# EAGLE design MgdOpna (EAGLE 9.6.2)
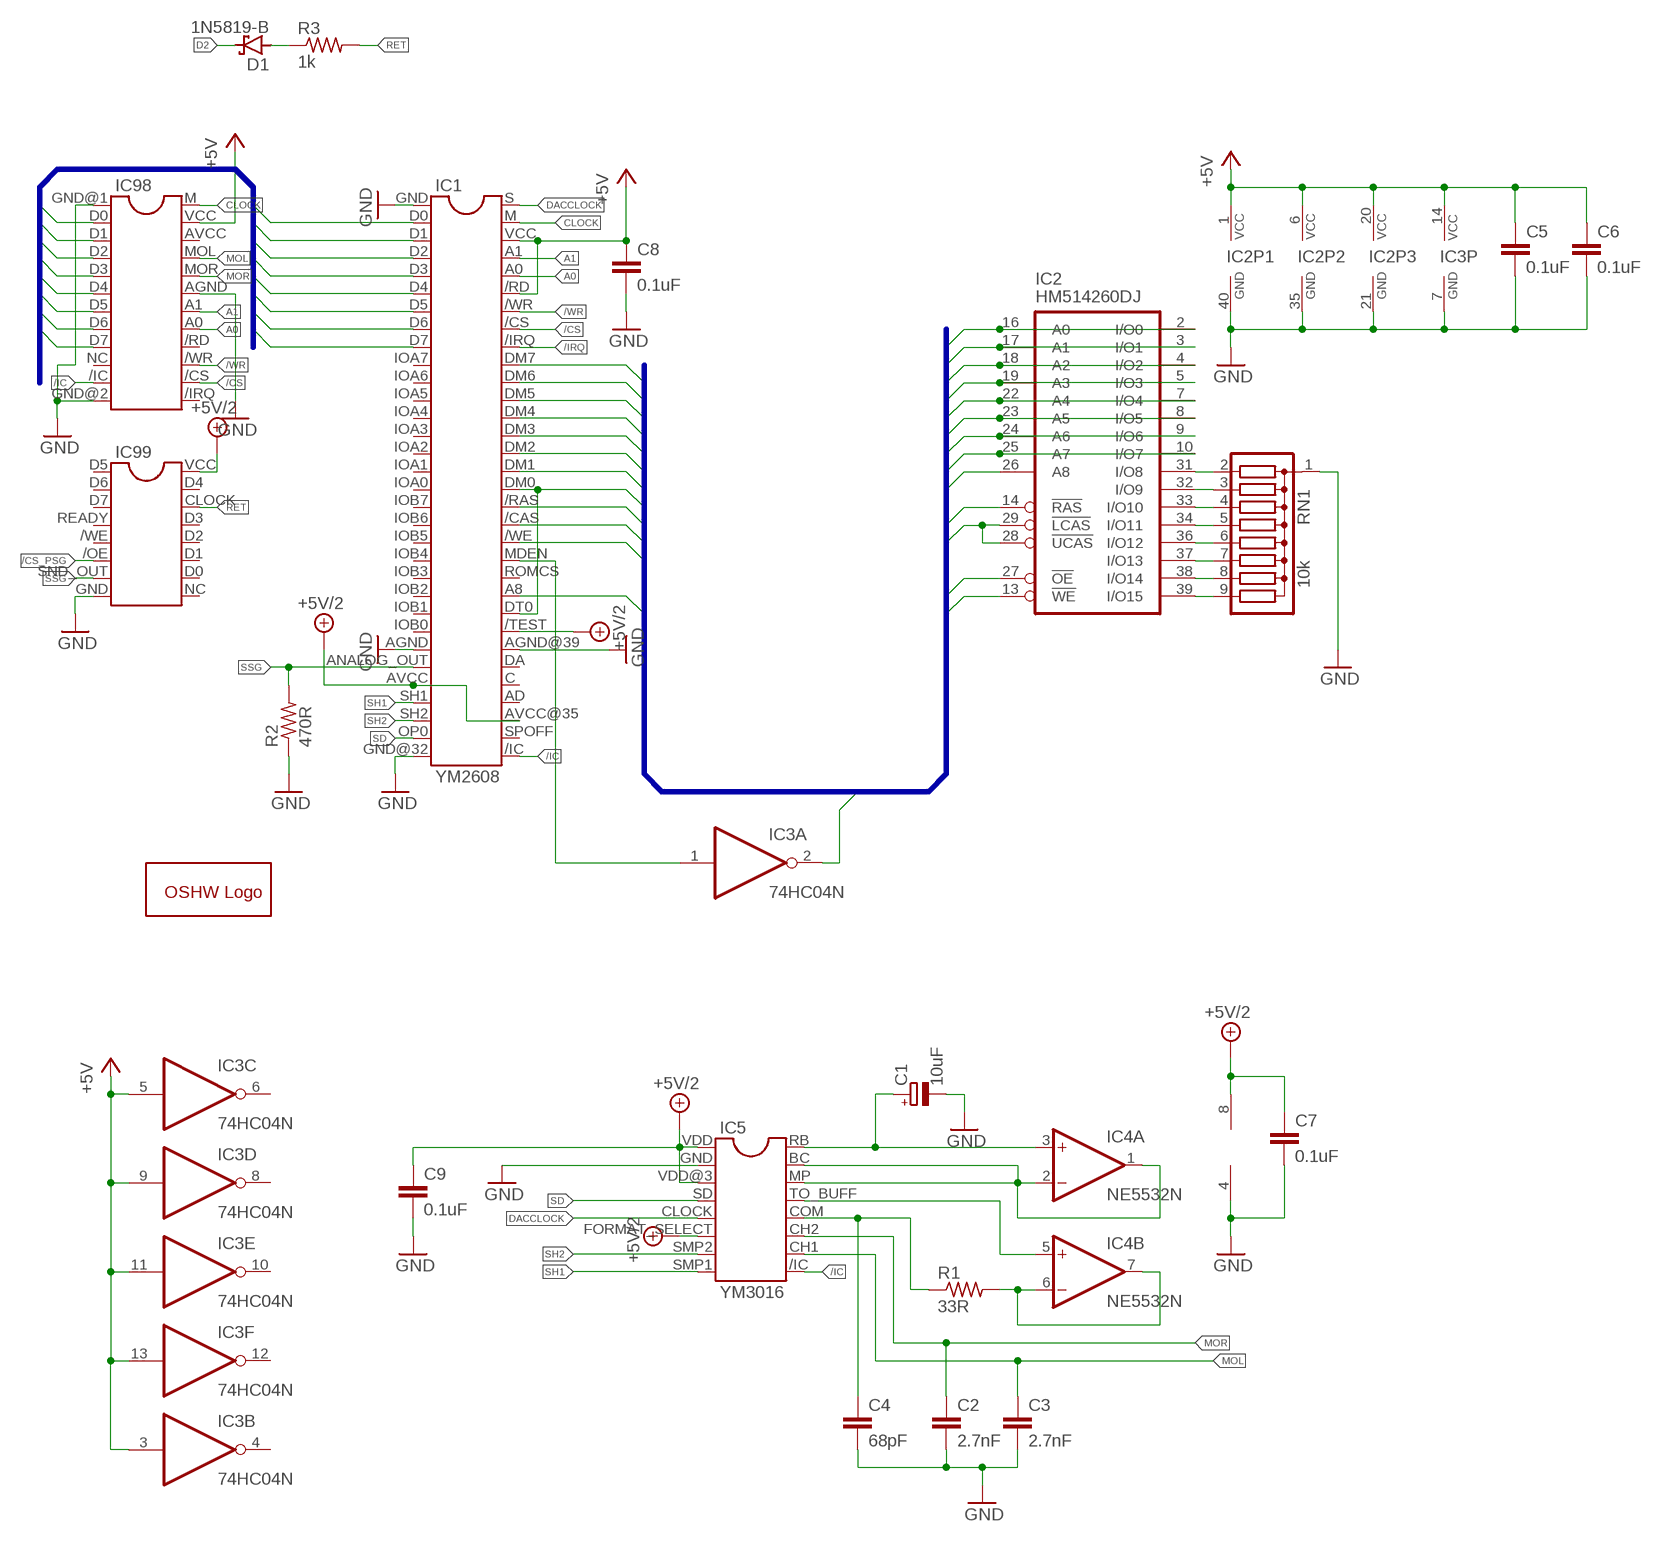
[diagram p0: schematic, sheet 1]

## Parts
C1  10uF  CPOL-EUE2.5-5  [E2,5-5]
C2  2.7nF  C-EU025-024X044  [C025-024X044]
C3  2.7nF  C-EU025-024X044  [C025-024X044]
C4  68pF  C-EU025-024X044  [C025-024X044]
C5  0.1uF  C-EU025-024X044  [C025-024X044]
C6  0.1uF  C-EU025-024X044  [C025-024X044]
C7  0.1uF  C-EU025-024X044  [C025-024X044]
C8  0.1uF  C-EU025-024X044  [C025-024X044]
C9  0.1uF  C-EU025-024X044  [C025-024X044]
D1  1N5819-B  [DO41-7.6]
GOLD_ORB_SM1  OSHWLOGOLOGO8MM  [OSHW_8MM]
IC1  YM2608  [YM2608]
IC2  HM514260DJ  [SOJ40-4]
IC3  74HC04N  [DIL14]
IC4  NE5532N  [DIL08]
IC5  YM3016  [YM3016]
IC98  YM2612YM2612_NOSILK  [YM2612_NOSILK]
IC99  SN76489SN76489_NOSILK  [SN76489_NOSILK]
R1  33R  R-US_0204/7  [0204/7]
R2  470R  R-US_0204/7  [0204/7]
R3  1k  R-US_0204/7  [0204/7]
RN1  10k  G08R  [SIL9]

## Nets
+5V: C5.1 C6.1 C8.1 IC1./RD IC1.VCC IC2.1(VCC) IC2.6(VCC) IC2.20(VCC) IC3.3(B:I) IC3.5(C:I) IC3.9(D:I) IC3.11(E:I) IC3.13(F:I) IC3.14(P:VCC) IC98.VCC
+5V/2: C7.1 C9.1 IC1./TEST IC1.AVCC IC1.AVCC@35(AVCC) IC4.8(P:V+) IC5.FORMAT_SELECT IC5.VDD IC5.VDD@3 IC99.VCC
/CAS: IC1./CAS IC2.28(!UCAS) IC2.29(!LCAS)
/CS: IC1./CS IC98./CS
/CS_PSG: IC99./OE
/IC: IC1./IC IC5./IC IC98./IC
/IRQ: IC1./IRQ
/OE: IC2.27(!OE) IC3.2(A:O)
/RAS: IC1./RAS IC2.14(!RAS)
/WE: IC1./WE IC2.13(!WE)
/WR: IC1./WR IC98./WR
A0: IC1.A0 IC98.A0
A1: IC1.A1 IC98.A1
A8: IC1.A8 IC2.26(A8)
CLOCK: IC1.M IC98.M
D0: IC1.D0 IC98.D0
D1: IC1.D1 IC98.D1
D2: D1.C IC1.D2 IC98.D2
D3: IC1.D3 IC98.D3
D4: IC1.D4 IC98.D4
D5: IC1.D5 IC98.D5
D6: IC1.D6 IC98.D6
D7: IC1.D7 IC98.D7
DACCLOCK: IC1.S IC5.CLOCK
DM0: IC1.DM0 IC1.DT0(DTO) IC2.2(I/O0) IC2.16(A0)
DM1: IC1.DM1 IC2.3(I/O1) IC2.17(A1)
DM2: IC1.DM2 IC2.4(I/O2) IC2.18(A2)
DM3: IC1.DM3 IC2.5(I/O3) IC2.19(A3)
DM4: IC1.DM4 IC2.7(I/O4) IC2.22(A4)
DM5: IC1.DM5 IC2.8(I/O5) IC2.23(A5)
DM6: IC1.DM6 IC2.9(I/O6) IC2.24(A6)
DM7: IC1.DM7 IC2.10(I/O7) IC2.25(A7)
GND: C1.- C2.2 C3.2 C4.2 C5.2 C6.2 C7.2 C8.2 C9.2 IC1.AGND IC1.AGND@39(AGND) IC1.GND IC1.GND@32(GND) IC2.21(GND) IC2.35(GND) IC2.40(GND) IC3.7(P:GND) IC4.4(P:V-) IC5.GND IC98.AGND IC98.GND@1(GND) IC98.GND@2(GND) IC99.GND R2.1 RN1.1
MOL: C3.1 IC5.CH1 IC98.MOL
MOR: C2.1 IC5.CH2 IC98.MOR
N$1: IC2.31(I/O8) RN1.2
N$2: IC2.32(I/O9) RN1.3
N$3: IC2.33(I/O10) RN1.4
N$4: IC2.34(I/O11) RN1.5
N$5: IC2.36(I/O12) RN1.6
N$6: IC2.37(I/O13) RN1.7
N$7: IC2.38(I/O14) RN1.8
N$8: IC2.39(I/O15) RN1.9
N$9: D1.A R3.1
N$10: IC1.MDEN IC3.1(A:I)
N$11: C1.+ IC4.3(A:+IN) IC5.RB
N$12: IC4.1(A:OUT) IC4.2(A:-IN) IC5.BC IC5.MP
N$13: IC4.5(B:+IN) IC5.TO_BUFF
N$14: IC4.6(B:-IN) IC4.7(B:OUT) R1.2
N$15: C4.1 IC5.COM R1.1
RET: IC99.CLOCK R3.2
SD: IC1.OP0 IC5.SD
SH1: IC1.SH1 IC5.SMP1
SH2: IC1.SH2 IC5.SMP2
SSG: IC1.ANALOG_OUT IC99.SND_OUT R2.2
Unconnected: IC1.AD IC1.C IC1.DA IC1.IOA0 IC1.IOA1 IC1.IOA2 IC1.IOA3 IC1.IOA4 IC1.IOA5 IC1.IOA6 IC1.IOA7 IC1.IOB0 IC1.IOB1 IC1.IOB2 IC1.IOB3 IC1.IOB4 IC1.IOB5 IC1.IOB6 IC1.IOB7 IC1.ROMCS IC1.SPOFF IC2.11(NC) IC2.12(NC) IC2.15(NC) IC2.30(NC) IC3.4(B:O) IC3.6(C:O) IC3.8(D:O) IC3.10(E:O) IC3.12(F:O) IC98./IRQ IC98./RD IC98.AVCC IC98.NC IC99./WE IC99.D0 IC99.D1 IC99.D2 IC99.D3 IC99.D4 IC99.D5 IC99.D6 IC99.D7 IC99.NC IC99.READY

## Buses
A[0..1],AVCC,/CS,D[0..7],/IC,M,/RD,VCC,/WR
A8,/CAS,DM[0..7],/OE,/RAS,/WE

## Library data of the parts
C1 = rcl:CPOL-EU: POLARIZED CAPACITOR, European symbol; SPICEPREFIX: C
C2-C9 = rcl:C-EU: CAPACITOR, European symbol; SPICEPREFIX: C
D1 = diode:1N581*: 1.0A SCHOTTKY BARRIER RECTIFIER Source: http://www.diodes.com/datasheets/ds23001.pdf
GOLD_ORB_SM1 = oshw:OSHWLOGO: The OSHW logo for PCB layout
IC1 = yammy-ha:YM2608
IC2 = memories:HM514260D: DRAM 256K x16 NEC Electronics Inc.
IC3 = 74xx-eu:74*04: Hex INVERTER
IC4 = linear:NE5532: AUDIO AMPLIFIER
IC5 = yammy-ha:YM3016
IC98 = yammy-ha:YM2612: Dual In Line
IC99 = retrosound:SN76489: Dual In Line / Socket
R1-R3 = rcl:R-US_: RESISTOR, American symbol; SPICEPREFIX: R
RN1 = resistor-sil:G08R: SIL RESISTOR; OC_FARNELL: unknown; OC_NEWARK: unknown

## Board
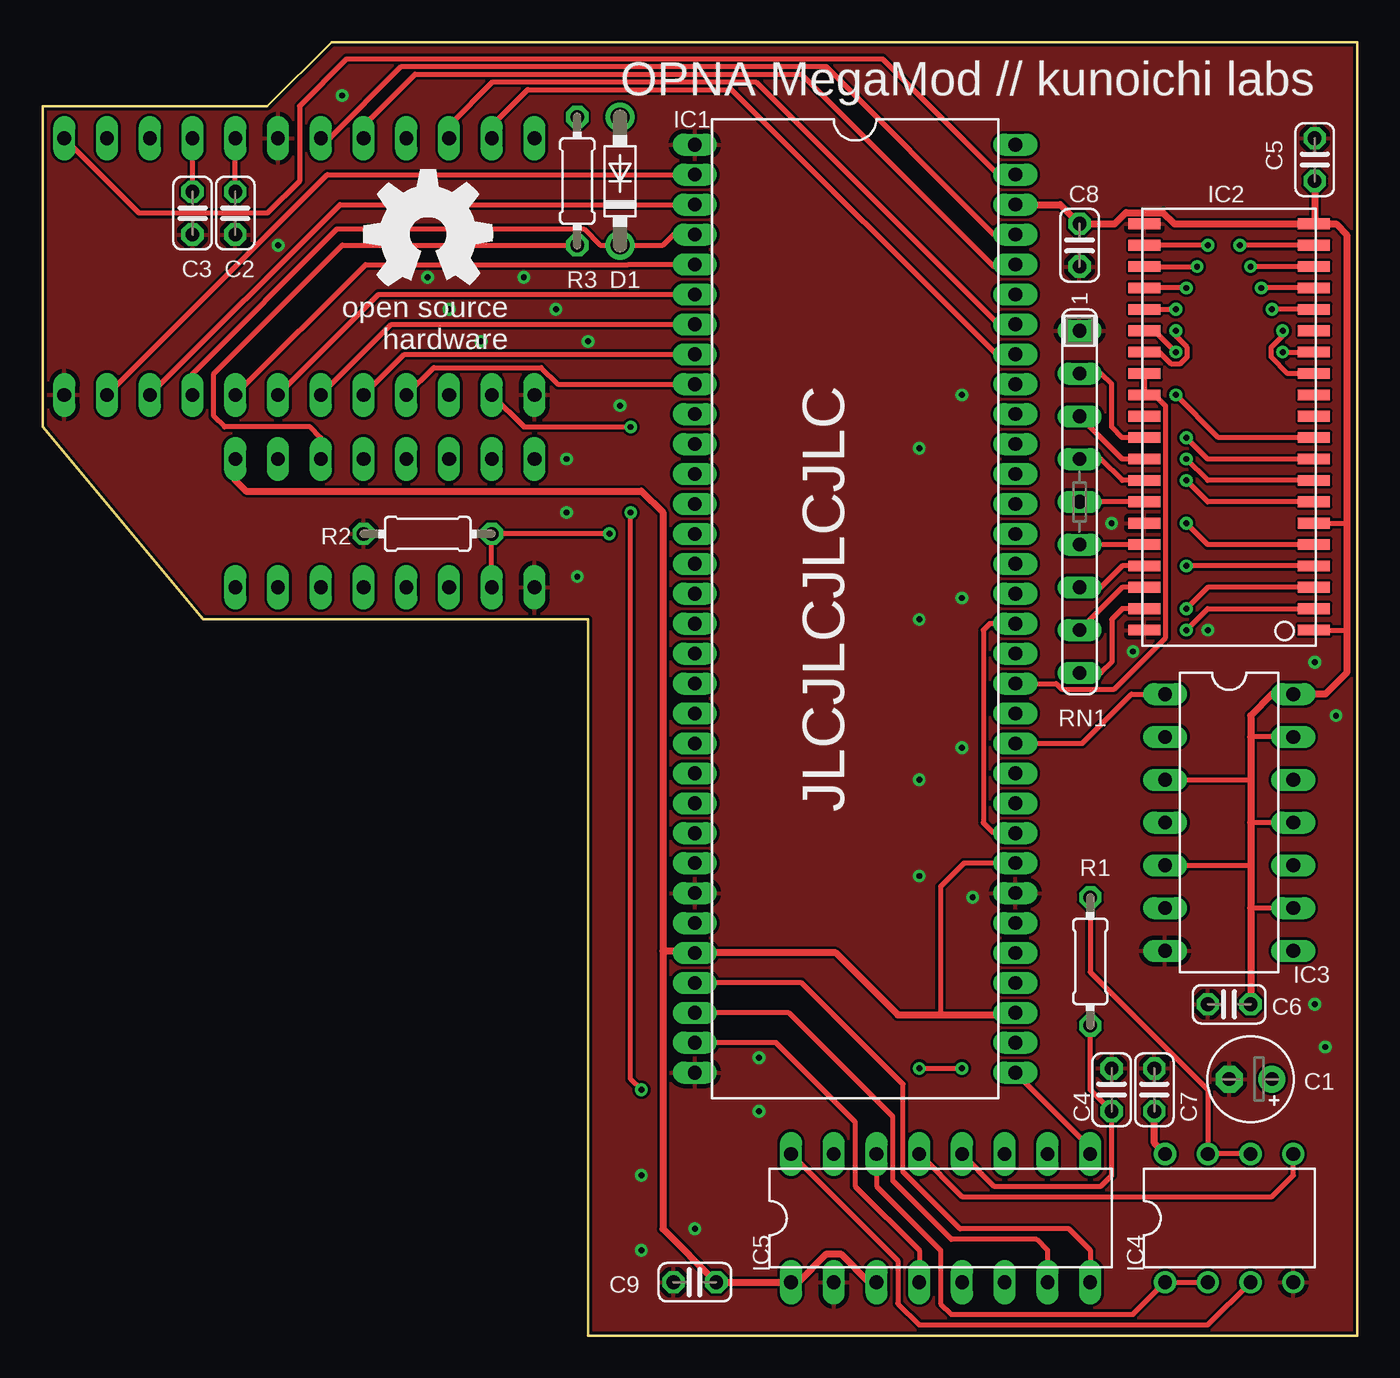
[diagram p1: board, top side]
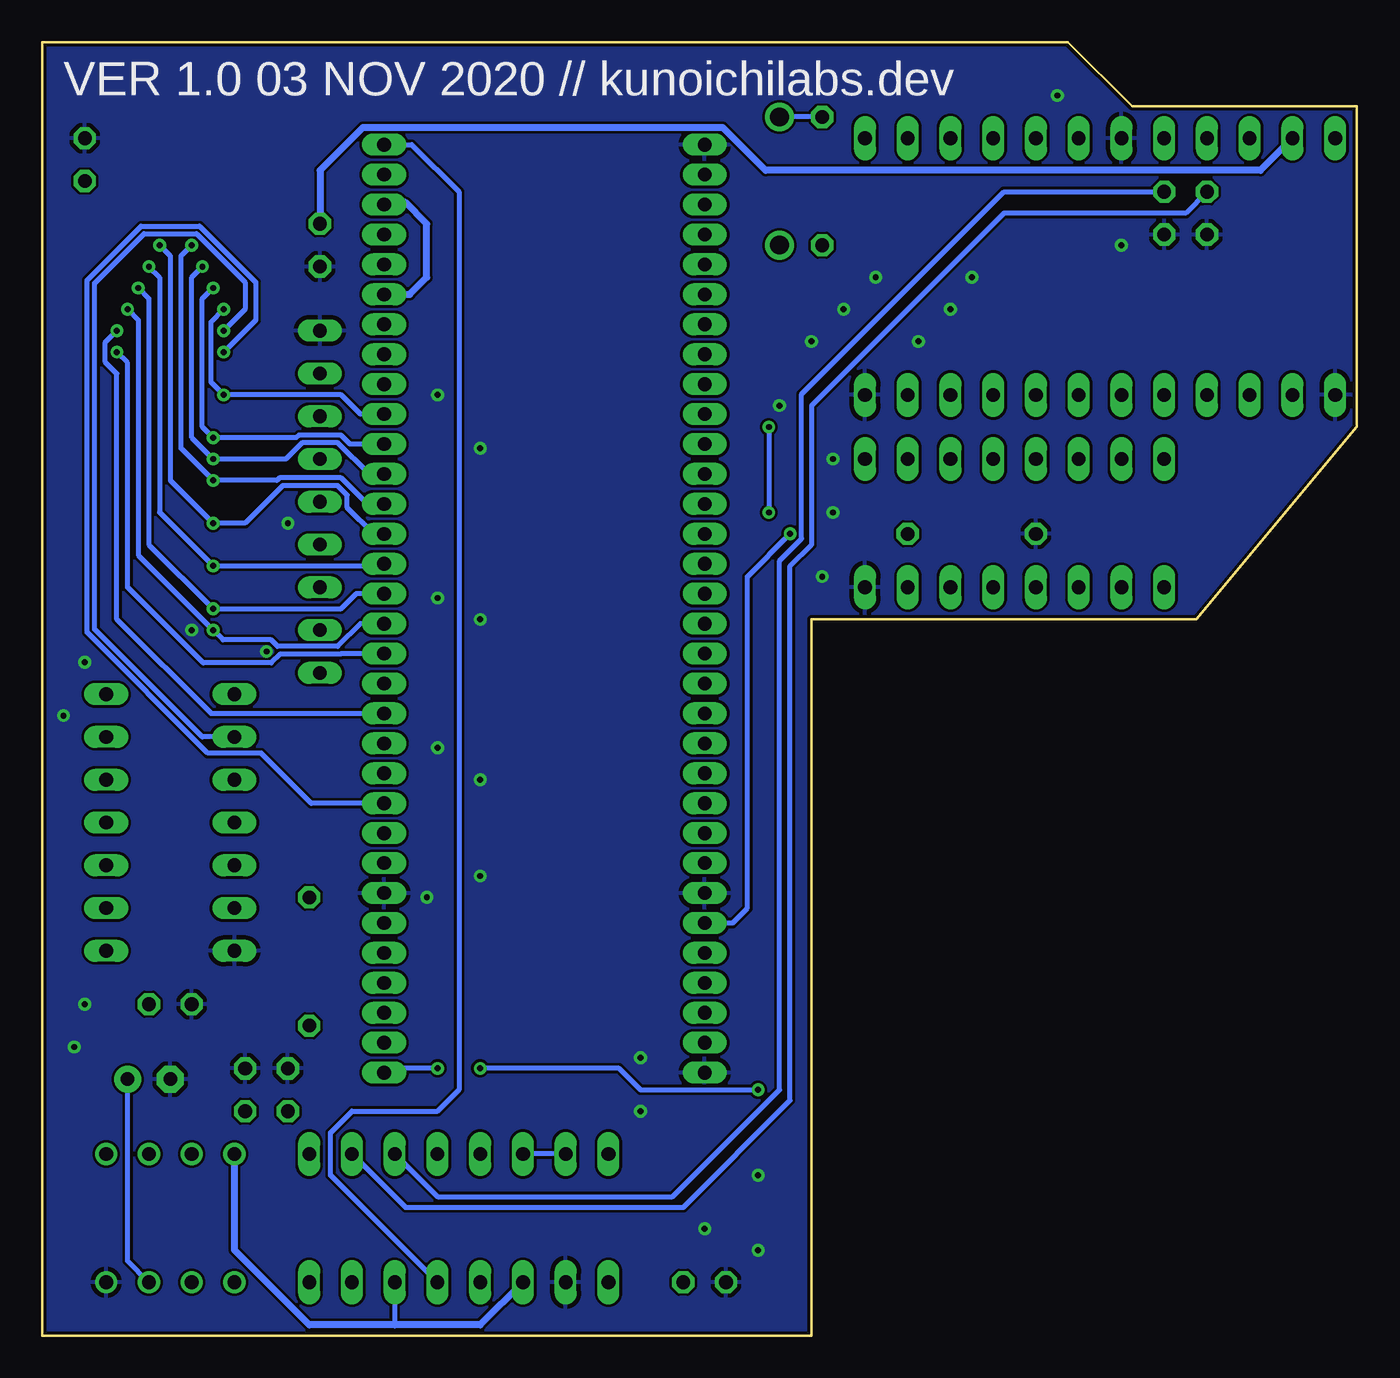
[diagram p2: board, bottom side, seen from below]

Size 78.11 x 76.83 mm. Coordinates in mm from the lower left corner, seen from the top.
Outline: 9.52,42.54 32.38,42.54 32.38,0 78.11,0 78.11,76.83 17.14,76.83 13.33,73.02 0,73.02 0,53.97 9.52,42.54
Copper layers (1*16): Top 0.035mm / dielectric 1.5mm / Bottom 0.035mm
Design rules "default *": minimum track width 6mil, minimum drill 0.35mm, track to track 6mil, track to pad 6mil, pad to pad 6mil, via to via 6mil, smd to smd 6mil, copper to edge 7mil, drill to drill 6mil, minimum pad ring 10mil, minimum via ring 8mil, stop-mask expansion 4mil, vias tented up to drill 20mil, thermal gap 10mil

### Footprints (pad centres in the part's own frame; a part is rotated, then mirrored left to right if it is on the bottom)
E2,5-5 = drill 0.813 pad 1.6: + -1.27,0 | drill 0.813 pad 1.6 octagon: - 1.27,0
C025-024X044 = drill 0.813 octagon: 1 -1.27,0; 2 1.27,0
DO41-7.6 = drill 1.1 pad 1.7: A 3.81,0; C -3.81,0
YM2608 = drill 0.813 long: /CAS 4.445,8.89; /CS -15.113,8.89; /IC 27.559,8.89; /IRQ -13.335,8.89; /RAS 2.667,8.89; /RD -18.669,8.89; /TEST 15.113,8.89; /WE 6.223,8.89; /WR -16.891,8.89; A0 -20.447,8.89; A1 -22.225,8.89; A8 11.557,8.89; AD 22.225,8.89; AGND 16.891,-10.16; AGND@39 16.891,8.89; ANALOG_OUT 18.669,-10.16; AVCC 20.447,-10.16; AVCC@35 24.003,8.89; C 20.447,8.89; D0 -25.781,-10.16; D1 -24.003,-10.16; D2 -22.225,-10.16; D3 -20.447,-10.16; D4 -18.669,-10.16; D5 -16.891,-10.16; D6 -15.113,-10.16; D7 -13.335,-10.16; DA 18.669,8.89; DM0 0.889,8.89; DM1 -0.889,8.89; DM2 -2.667,8.89; DM3 -4.445,8.89; DM4 -6.223,8.89; DM5 -8.001,8.89; DM6 -9.779,8.89; DM7 -11.557,8.89; DT0 13.335,8.89; GND -27.559,-10.16; GND@32 27.559,-10.16; IOA0 0.889,-10.16; IOA1 -0.889,-10.16; IOA2 -2.667,-10.16; IOA3 -4.445,-10.16; IOA4 -6.223,-10.16; IOA5 -8.001,-10.16; IOA6 -9.779,-10.16; IOA7 -11.557,-10.16; IOB0 15.113,-10.16; IOB1 13.335,-10.16; IOB2 11.557,-10.16; IOB3 9.779,-10.16; IOB4 8.001,-10.16; IOB5 6.223,-10.16; IOB6 4.445,-10.16; IOB7 2.667,-10.16; M -25.781,8.89; MDEN 8.001,8.89; OP0 25.781,-10.16; ROMCS 9.779,8.89; S -27.559,8.89; SH1 22.225,-10.16; SH2 24.003,-10.16; SPOFF 25.781,8.89; VCC -24.003,8.89
SOJ40-4 = smd 0.635 x 1.905: 1 -10.16,-5.029; 2 -8.89,-5.029; 3 -7.62,-5.029; 4 -6.35,-5.029; 5 -5.08,-5.029; 6 -3.81,-5.029; 7 -2.54,-5.029; 8 -1.27,-5.029; 9 0,-5.029; 10 1.27,-5.029; 11 2.54,-5.029; 12 3.81,-5.029; 13 5.08,-5.029; 14 6.35,-5.029; 15 7.62,-5.029; 16 8.89,-5.029; 17 10.16,-5.029; 18 11.43,-5.029; 19 12.7,-5.029; 20 13.97,-5.029; 21 13.97,5.029; 22 12.7,5.029; 23 11.43,5.029; 24 10.16,5.029; 25 8.89,5.029; 26 7.62,5.029; 27 6.35,5.029; 28 5.08,5.029; 29 3.81,5.029; 30 2.54,5.029; 31 1.27,5.029; 32 0,5.029; 33 -1.27,5.029; 34 -2.54,5.029; 35 -3.81,5.029; 36 -5.08,5.029; 37 -6.35,5.029; 38 -7.62,5.029; 39 -8.89,5.029; 40 -10.16,5.029
DIL14 = drill 0.813 long: 1 -7.62,-3.81; 2 -5.08,-3.81; 3 -2.54,-3.81; 4 0,-3.81; 5 2.54,-3.81; 6 5.08,-3.81; 7 7.62,-3.81; 8 7.62,3.81; 9 5.08,3.81; 10 2.54,3.81; 11 0,3.81; 12 -2.54,3.81; 13 -5.08,3.81; 14 -7.62,3.81
DIL08 = drill 0.813 pad 1.27: 1 -3.81,-3.81; 2 -1.27,-3.81; 3 1.27,-3.81; 4 3.81,-3.81; 5 3.81,3.81; 6 1.27,3.81; 7 -1.27,3.81; 8 -3.81,3.81
YM3016 = drill 0.813 long: /IC 8.89,3.81; BC -6.35,3.81; CH1 6.35,3.81; CH2 3.81,3.81; CLOCK 1.27,-3.81; COM 1.27,3.81; FORMAT_SELECT 3.81,-3.81; GND -6.35,-3.81; MP -3.81,3.81; RB -8.89,3.81; SD -1.27,-3.81; SMP1 8.89,-3.81; SMP2 6.35,-3.81; TO_BUFF -1.27,3.81; VDD -8.89,-3.81; VDD@3 -3.81,-3.81
YM2612_NOSILK = drill 0.813 long: /CS 11.43,7.62; /IC 11.43,-7.62; /IRQ 13.97,7.62; /RD 6.35,7.62; /WR 8.89,7.62; A0 3.81,7.62; A1 1.27,7.62; AGND -1.27,7.62; AVCC -8.89,7.62; D0 -11.43,-7.62; D1 -8.89,-7.62; D2 -6.35,-7.62; D3 -3.81,-7.62; D4 -1.27,-7.62; D5 1.27,-7.62; D6 3.81,-7.62; D7 6.35,-7.62; GND@1 -13.97,-7.62; GND@2 13.97,-7.62; M -13.97,7.62; MOL -6.35,7.62; MOR -3.81,7.62; NC 8.89,-7.62; VCC -11.43,7.62
SN76489_NOSILK = drill 0.813 long: /OE 8.89,-3.81; /WE 6.35,-3.81; CLOCK 1.27,3.81; D0 11.43,3.81; D1 8.89,3.81; D2 6.35,3.81; D3 3.81,3.81; D4 -1.27,3.81; D5 -3.81,-3.81; D6 -1.27,-3.81; D7 1.27,-3.81; GND 13.97,-3.81; NC 13.97,3.81; READY 3.81,-3.81; SND_OUT 11.43,-3.81; VCC -3.81,3.81
0204/7 = drill 0.813 octagon: 1 -3.81,0; 2 3.81,0
SIL9 = drill 0.813 long: 1 -10.16,0; 2 -7.62,0; 3 -5.08,0; 4 -2.54,0; 5 0,0; 6 2.54,0; 7 5.08,0; 8 7.62,0; 9 10.16,0

### Placement (x,y rotation side)
C1  71.75,15.24 180 top
C2  11.43,66.67 270 top
C3  8.89,66.67 270 top
C4  63.5,14.6 90 top
C5  75.56,69.85 90 top
C6  70.48,19.68 180 top
C7  66.04,14.6 90 top
C8  61.59,64.77 270 top
C9  38.73,3.17 180 top
D1  34.29,68.58 90 top
GOLD_ORB_SM1  22.86,65.41 0 top
IC1  48.89,43.18 270 top
IC2  70.48,52.07 90 top
IC3  70.48,30.48 270 top
IC4  70.48,6.98 0 top
IC5  53.34,6.98 0 top
IC98  15.24,63.5 0 top
IC99  15.24,48.26 0 top
R1  62.23,22.22 90 top
R2  22.86,47.62 0 top
R3  31.75,68.58 270 top
RN1  61.59,49.53 270 top

### Tracks (layer width: path | path; a pad name or v marks a point on that pad's centre or on a via)
+5V
  Top 0.305: IC3.9 71.75,25.4 | IC3.5 71.75,27.94 | IC2.1 77.47,41.91 | IC2.6 77.47,48.26 | IC3.13 71.75,35.56 | IC3.11 71.75,30.48 | IC3.3 71.75,33.02
  Top 0.406: 75.56,66.04 IC2.20 70.48,66.04 67.23,66.04 66.56,66.71 64.36,66.71 63.68,66.04 C8.1 60.45,67.18 IC1.VCC | 75.56,66.04 76.83,66.04 77.47,65.41 77.47,48.26 77.47,41.91 77.47,39.37 76.2,38.1 IC3.14 73.02,38.1 71.75,36.83 71.75,35.56 71.75,33.02 71.75,30.48 71.75,27.94 71.75,25.4 C6.1 | C5.1 75.56,66.04
  Bottom 0.406: IC98.VCC 5.71,69.21 35.11,69.21 37.65,71.75 59.05,71.75 61.59,69.21 C8.1 | IC1./RD 56.26,61.85 55.24,62.86 55.24,66.04 56.52,67.31 57.66,67.31 IC1.VCC
+5V/2
  Top 0.305: IC1./TEST 54.74,28.07 53.34,26.67 53.34,19.05
  Top 0.406: IC99.VCC 11.43,50.8 12.06,50.16 35.56,50.16 36.83,48.89 36.83,22.86 | 36.83,22.86 36.83,6.35 C9.1 IC5.VDD 44.89,3.17 46.57,4.85 47.41,4.85 49.09,3.17 IC5.VDD@3 | IC1.AVCC@35 57.66,19.05 53.34,19.05 50.8,19.05 47.12,22.73 IC1.AVCC 38.61,22.86 36.83,22.86 | IC4.8 66.04,11.43 C7.1
  Bottom 0.305: IC5.FORMAT_SELECT 57.15,0.63
  Bottom 0.406: IC5.VDD@3 52.07,0.63 57.15,0.63 62.23,0.63 66.67,5.08 IC4.8
/CAS
  Top 0.305: IC2.28 IC2.29 66.04,55.88 66.71,55.21 66.71,41.47 63.65,38.4 60.53,38.4 60.2,38.73 IC1./CAS
/CS
  Top 0.305: IC98./CS 26.67,71.88 28.81,74.02 40.92,74.02 56.64,58.29 IC1./CS
/IC  (via drill 0.35)
  Top 0.305: v52.07,15.87 v54.61,15.87 | IC1./IC 62.23,11.18 IC5./IC | IC98./IC 28.57,53.97 v34.92,53.97 | v35.56,14.6 34.92,15.24 v34.92,48.89
  Bottom 0.305: v52.07,15.87 43.81,15.87 42.55,14.6 v35.56,14.6 | v54.61,15.87 57.53,15.87 IC1./IC | v34.92,53.97 v34.92,48.89
/OE  (via drill 0.35)
  Top 0.305: v67.31,59.69 67.31,59.39 67.99,58.7 67.99,58.14 67.59,57.74 67.03,57.74 66.34,58.42 IC2.27
  Bottom 0.305: IC3.2 68.58,35.56 74.98,41.96 74.98,62.51 72.04,65.45 68.93,65.45 66.04,62.56 66.04,60.96 v67.31,59.69
/RAS  (via drill 0.35)
  Top 0.305: v73.66,58.42 IC2.14
  Bottom 0.305: v73.66,58.42 73.02,57.78 73.02,44.45 68.53,39.96 64.49,39.96 63.96,40.49 60.34,40.49 60.32,40.51 IC1./RAS
/WE  (via drill 0.35)
  Top 0.305: v73.66,59.69 73.66,59.39 72.98,58.7 72.98,58.14 73.96,57.15 IC2.13
  Bottom 0.305: v73.66,59.69 74.34,59.01 74.34,57.83 73.66,57.15 73.66,42.54 68.07,36.96 IC1./WE
/WR
  Top 0.305: IC98./WR 24.13,71.88 26.73,74.47 42.37,74.47 56.77,60.07 IC1./WR
A0
  Top 0.305: IC98.A0 19.05,71.88 22.1,74.93 45.09,74.93 56.52,63.5 57.66,63.5 IC1.A0
A1
  Top 0.305: IC98.A1 17.02,71.12 21.29,75.39 46.53,75.39 56.52,65.41 IC1.A1
A8  (via drill 0.35)
  Top 0.305: v67.31,58.42 66.04,59.69 IC2.26
  Bottom 0.305: IC1.A8 62.1,31.62 65.08,34.59 68.26,34.59 75.44,41.77 75.44,62.7 72.23,65.91 68.74,65.91 65.41,62.57 65.41,60.32 v67.31,58.42
CLOCK
  Top 0.305: IC1.M 56.77,68.96 49.89,75.84 18.06,75.84 15.24,73.02 15.24,68.58 13.33,66.67 5.71,66.67 IC98.M
D0
  Top 0.305: IC98.D0 16.89,68.96 IC1.D0
D1
  Top 0.305: IC98.D1 17.65,67.18 IC1.D1
D2
  Top 0.305: IC98.D2 8.89,57.15 17.47,65.73 32.15,65.73 33.11,64.77 D1.C 36.83,64.77 37.46,65.41 IC1.D2
D3
  Top 0.305: IC1.D3 34.78,63.63 34.77,63.61 19.16,63.61 IC98.D3
D4
  Top 0.305: IC98.D4 19.68,61.59 19.94,61.85 IC1.D4
D5
  Top 0.305: IC98.D5 20.7,60.07 IC1.D5
D6
  Top 0.305: IC98.D6 21.46,58.29 IC1.D6
D7
  Top 0.305: IC98.D7 23.22,57.51 29.61,57.51 30.6,56.51 IC1.D7
DACCLOCK
  Bottom 0.305: IC1.S 56.13,70.74 53.34,67.94 53.34,14.6 54.61,13.33 59.69,13.33 60.96,12.06 60.96,9.52 IC5.CLOCK
DM0  (via drill 0.35)
  Top 0.305: IC2.16 v73.02,60.96 | IC1.DT0 56.52,29.84 55.88,30.48 55.88,41.91 56.26,42.29 IC1.DM0 | v67.94,41.91 69.22,43.18 IC2.2
  Bottom 0.305: v73.02,60.96 72.39,60.32 72.39,46.35 v67.94,41.91 67.36,41.32 64.49,41.32 64.11,40.94 60.53,40.94 59.19,42.29 IC1.DM0
DM1  (via drill 0.35)
  Top 0.305: IC2.17 v72.39,62.23 | IC2.3 69.22,44.45 v67.94,43.18
  Bottom 0.305: IC1.DM1 59.44,44.07 60.33,43.18 v67.94,43.18 71.75,46.99 71.75,61.59 v72.39,62.23
DM2  (via drill 0.35)
  Top 0.305: IC2.18 v71.75,63.5 | IC2.4 v67.94,45.72
  Bottom 0.305: v71.75,63.5 71.12,62.86 71.12,48.89 v67.94,45.72 57.91,45.72 IC1.DM2
DM3  (via drill 0.35)
  Top 0.305: IC2.19 v71.12,64.77 | IC2.5 69.22,46.99 v67.94,48.26
  Bottom 0.305: v71.12,64.77 70.48,64.13 70.48,50.8 v67.94,48.26 66.04,48.26 63.8,50.49 60.53,50.49 59.97,49.93 59.97,49.17 58.42,47.62 IC1.DM3
DM4  (via drill 0.35)
  Top 0.305: IC2.7 69.22,49.53 v67.94,50.8 | v69.22,64.77 IC2.22
  Bottom 0.305: v69.22,64.77 69.85,64.13 69.85,52.7 v67.94,50.8 64.15,50.8 63.99,50.95 60.34,50.95 58.8,49.4 IC1.DM4
DM5  (via drill 0.35)
  Top 0.305: IC2.8 69.22,50.8 v67.94,52.07 | IC2.23 v68.58,63.5
  Bottom 0.305: IC1.DM5 58.68,51.18 60.53,53.03 62.66,53.03 63.62,52.07 v67.94,52.07 69.22,53.34 69.22,62.86 v68.58,63.5
DM6  (via drill 0.35)
  Top 0.305: IC2.9 69.22,52.07 v67.94,53.34 | v67.94,62.23 IC2.24
  Bottom 0.305: IC1.DM6 59.81,52.96 60.34,53.49 62.84,53.49 63,53.34 v67.94,53.34 68.58,53.97 68.58,61.59 v67.94,62.23
DM7  (via drill 0.35)
  Top 0.305: IC2.10 69.85,53.34 v67.31,55.88 | IC2.25 v67.31,60.96
  Bottom 0.305: IC1.DM7 59.18,54.74 60.33,55.88 v67.31,55.88 68.07,56.64 68.07,60.2 v67.31,60.96
GND  (via drill 0.35)
  other vias: 63.5,48.26 64.77,40.64 69.22,41.91 22.86,62.86 28.57,62.86 24.13,60.96 30.48,60.96 26.03,59.05 32.38,59.05 13.97,64.77 17.78,73.66 34.29,55.24 31.11,52.07 31.11,48.89 31.75,45.08 55.24,26.03 52.07,27.3 42.55,16.51 42.55,13.33 38.73,6.35 35.56,9.52 35.56,5.08 52.07,33.02 54.61,34.92 52.07,42.54 54.61,43.81 52.07,52.7 54.61,55.88 75.56,40 76.83,36.83 75.56,19.68 76.2,17.14
  pour Top: -4.45,83.82 103.5,83.82 103.5,-1.91 -12.07,-1.91 -12.07,83.82
  pour Bottom: -10.79,82.55 104.77,82.55 104.77,-3.18 -10.79,-3.18
MOL
  Top 0.305: C3.1 IC98.MOL
  Bottom 0.305: IC5.CH1 56.52,7.62 40,7.62 33.66,13.97 33.66,45.72 32.38,46.99 32.38,55.24 20.95,66.67 10.16,66.67 C3.1
MOR
  Top 0.305: C2.1 IC98.MOR
  Bottom 0.305: IC5.CH2 54.61,8.25 40.64,8.25 34.29,14.6 34.29,46.02 32.97,47.34 32.97,55.93 20.95,67.94 C2.1
N$1
  Top 0.305: IC2.31 64.14,53.34 63.5,53.97 63.5,56.51 62.86,57.15 RN1.2
N$2
  Top 0.305: IC2.32 64.14,52.07 RN1.3
N$3
  Top 0.305: IC2.33 64.14,50.8 62.86,52.07 RN1.4
N$4
  Top 0.305: IC2.34 RN1.5
N$5
  Top 0.305: IC2.36 RN1.6
N$6
  Top 0.305: IC2.37 64.14,45.72 62.86,44.45 RN1.7
N$7
  Top 0.305: IC2.38 64.14,44.45 RN1.8
N$8
  Top 0.305: IC2.39 64.14,43.18 63.5,42.54 63.5,40 62.86,39.37 RN1.9
N$9
  Bottom 0.305: R3.1 D1.A
N$10
  Top 0.305: IC1.MDEN 61.75,35.18 64.67,38.1 IC3.1
N$11
  Top 0.305: IC5.RB 50.8,4.44 50.8,1.91 52.07,0.63 69.22,0.63 IC4.3
  Bottom 0.305: IC4.3 73.02,4.44 C1.+
N$12
  Top 0.305: IC5.MP 49.53,8.89 53.34,5.08 53.34,1.91 53.97,1.27 64.77,1.27 IC4.1 IC4.2
  Bottom 0.305: IC5.BC IC5.MP
N$13
  Top 0.305: IC5.TO_BUFF 54.61,8.25 73.02,8.25 74.3,9.52 IC4.5
N$14
  Top 0.305: IC4.6 IC4.7 69.22,14.6 62.23,21.59 R1.2
N$15
  Top 0.305: IC5.COM 56.52,8.89 62.86,8.89 63.5,9.52 C4.1 62.23,14.6 R1.1
RET
  Top 0.305: IC99.CLOCK 16.51,53.34 15.87,53.97 10.79,53.97 10.16,54.61 10.16,57.15 17.78,64.77 R3.2
SD
  Top 0.305: IC5.SD 52.07,5.08 48.26,8.89 48.26,12.7 43.56,17.4 IC1.OP0
SH1
  Top 0.305: IC5.SMP1 62.23,5.08 60.96,6.35 54.49,6.35 51.1,9.73 51.1,14.93 45.09,20.95 IC1.SH1
SH2
  Top 0.305: IC5.SMP2 59.69,5.08 59.05,5.71 53.97,5.71 50.49,9.19 50.49,13 44.32,19.18 IC1.SH2
SSG  (via drill 0.35)
  Top 0.305: v33.66,47.62 R2.2 IC99.SND_OUT
  Bottom 0.305: v33.66,47.62 36.2,45.08 36.2,25.4 37.08,24.51 IC1.ANALOG_OUT

### Text on the board
tNames: OPNA MegaMod // kunoichi labs | JLCJLCJLCJLC
bNames: VER 1.0 03 NOV 2020 // kunoichilabs.dev